# Altium project ESP32S3.PrjPcb
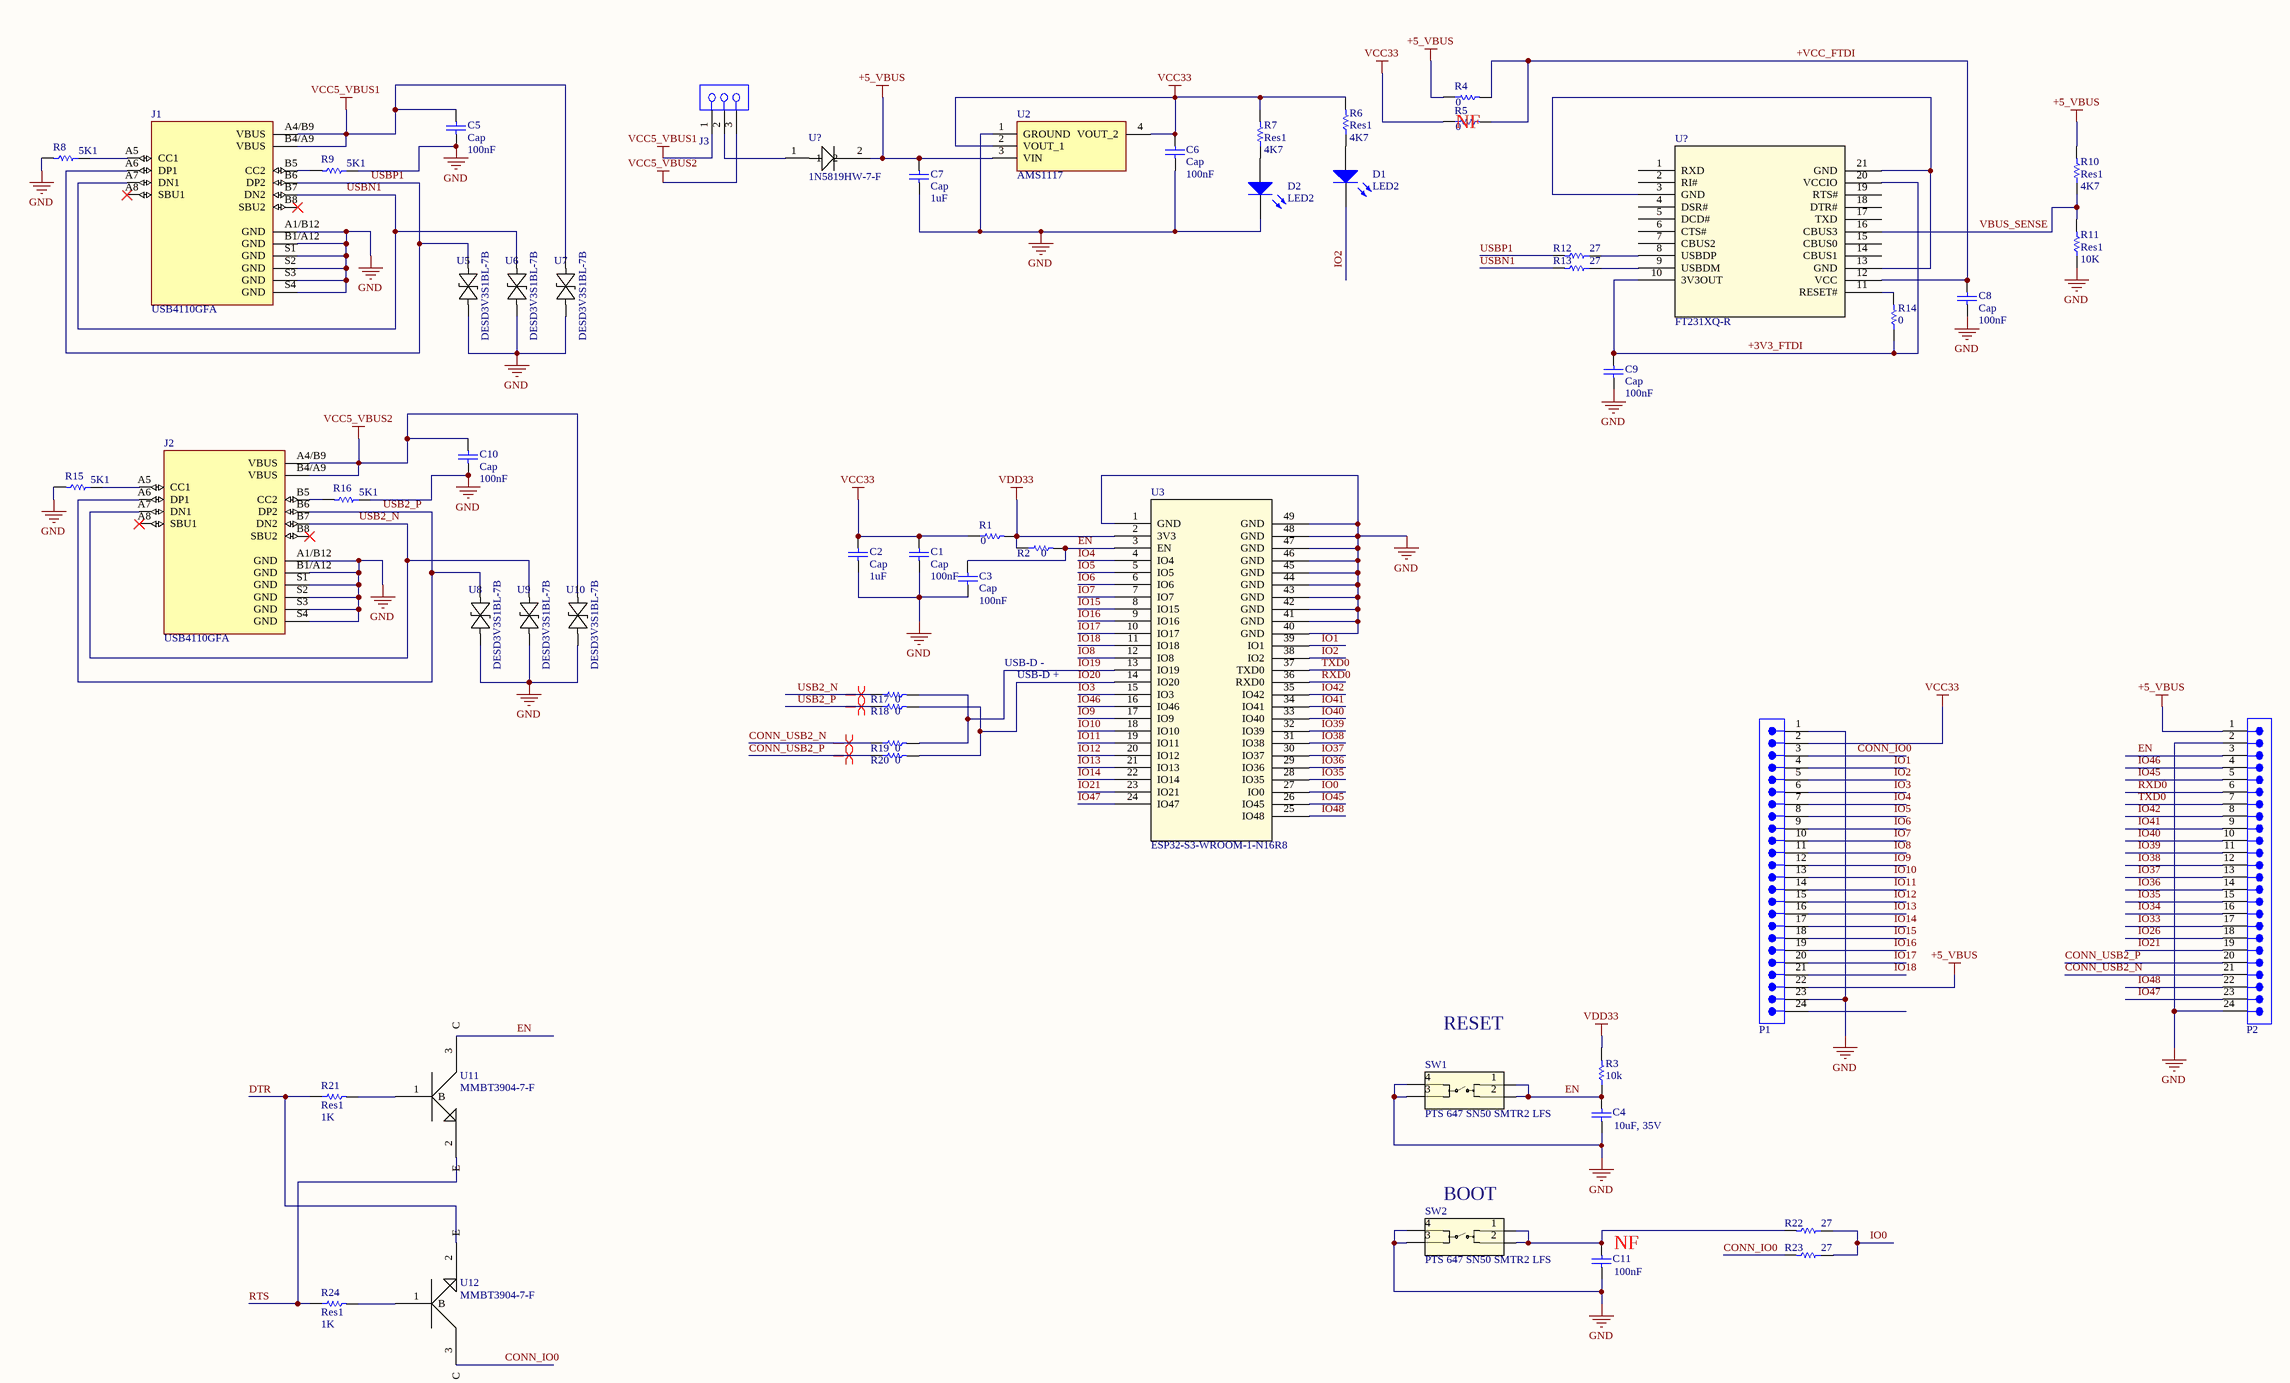
[diagram p0: esp32s3.SchDoc]
1 sheet, 56 parts. Net scope: global (net labels, ports and power ports of the same name join across sheets).
Board file: esp32s3.PcbDoc

## Sheet esp32s3.SchDoc
size C; SheetNumber: 1; SheetTotal: 1; SPICEModelCachePUVMUMUR: <root> / <DocumentId>PUVMUMUR</DocumentId> / <CacheFrame Number="0"> / <Model Name="led2" Kind="MDL"> / <Text>*Typ RED,GREEN,YELLOW,AMBER GaAs LED: Vf=2.1V Vr=4V If=40mA trr=3uS / *LED Pinout: 1=A, 2=K / .MODEL LED2 D (IS=93.1P RS=42M N=4.61 BV=4 IBV=10U / + CJO=2.97P VJ=.75 M=.333 TT=4.32U)</Text> / </Model> / </CacheFrame> / </root>

### Parts
(Parts that share a designator on the sheet are numbered #1, #2 ... from top to bottom, then left to right.)
C1  Cap  value 100nF  [C1206]
C2  Cap  value 1uF  [C1206]
C3  Cap  value 100nF  [C1206]
C4  value 10uF, 35V  [C1206]
C5  Cap  value 100nF  [C1206]
C6  Cap  value 100nF  [C1206]
C7  Cap  value 1uF  [C1206]
C8  Cap  value 100nF  [C1206]
C9  Cap  value 100nF  [C1206]
C10  Cap  value 100nF  [C1206]
C11  value 100nF  [C1206]
D1  LED2  [3.2X1.6X1.1]
D2  LED2  [3.2X1.6X1.1]
J1  USB4110GFA  [GCT_USB4110GFA]
J2  USB4110GFA  [GCT_USB4110GFA]
J3  61300311821  [61300311821]  (value not drawn)
P1  61302411121  [61302411121]  (value not drawn)
P2  61302411121  [61302411121]  (value not drawn)
R1  value 0  [C1206]
R2  value 0  [C1206]
R3  value 10k  [C1206]
R4  value 0  [C1206]
R5  value 0  [C1206]
R6  Res1  value 4K7  [C1206]
R7  Res1  value 4K7  [C1206]
R8  value 5K1  [C1206]
R9  value 5K1  [C1206]
R10  Res1  value 4K7  [C1206]
R11  Res1  value 10K  [C1206]
R12  value 27  [C1206]
R13  value 27  [C1206]
R14  value 0  [C1206]
R15  value 5K1  [C1206]
R16  value 5K1  [C1206]
R17  value 0  [C1206]
R18  value 0  [C1206]
R19  value 0  [C1206]
R20  value 0  [C1206]
R21  Res1  value 1K  [C1206]
R22  value 27  [C1206]
R23  value 27  [C1206]
R24  Res1  value 1K  [C1206]
SW1  PTS 647 SN50 SMTR2 LFS  [PTS 647 SN50 SMTR2 LFS-L]
SW2  PTS 647 SN50 SMTR2 LFS  [PTS 647 SN50 SMTR2 LFS-L]
U2  AMS1117  [SOT229P700X180-4N]
U3  ESP32-S3-WROOM-1-N16R8  [ESP32-S3-WROOM-1_EXP]
U5  DESD3V3S1BL-7B  [X1-DFN1006-2_RH_DIO]
U6  DESD3V3S1BL-7B  [X1-DFN1006-2_RH_DIO]
U7  DESD3V3S1BL-7B  [X1-DFN1006-2_RH_DIO]
U8  DESD3V3S1BL-7B  [X1-DFN1006-2_RH_DIO]
U9  DESD3V3S1BL-7B  [X1-DFN1006-2_RH_DIO]
U10  DESD3V3S1BL-7B  [X1-DFN1006-2_RH_DIO]
U11  MMBT3904-7-F  [SOT-23_1_DIO]
U12  MMBT3904-7-F  [SOT-23_1_DIO]
U?#1  1N5819HW-7-F  [1N5819HW-7-F_DIO]
U?#2  FT231XQ-R  [QFN20_FT231XQ_FTD]

### Nets
+5_VBUS: C7.2 P1.22 P2.1 R4.1 R10.2 U2.3(VIN) U?#1.2
GND: C1.1 C2.1 C3.1 C4.1 C5.1 C6.1 C7.1 C8.1 C9.1 C10.1 C11.1 D2.2(K) J1.A1/B12(GND) J1.B1/A12(GND) J1.S1(GND) J1.S2(GND) J1.S3(GND) J1.S4(GND) J2.A1/B12(GND) J2.B1/A12(GND) J2.S1(GND) J2.S2(GND) J2.S3(GND) J2.S4(GND) P1.1 P1.23 P2.2 P2.24 R8.2 R9.1 R11.1 R15.2 R16.1 SW1.3 SW1.4 SW2.3 SW2.4 U2.1(GROUND) U3.1(GND) U3.40(GND) U3.41(GND) U3.42(GND) U3.43(GND) U3.44(GND) U3.45(GND) U3.46(GND) U3.47(GND) U3.48(GND) U3.49(GND) U5.2 U6.2 U7.2 U8.2 U9.2 U10.2
VCC5_VBUS1: C5.2 J1.A4/B9(VBUS) J1.B4/A9(VBUS) J3.1 U7.1
VCC5_VBUS2: C10.2 J2.A4/B9(VBUS) J2.B4/A9(VBUS) J3.3 U10.1
VCC33: C1.2 C2.2 C6.2 P1.2 R1.1 R5.1 R6.2 R7.2 U2.2(VOUT_1) U2.4(VOUT_2)
VDD33: R1.2 R2.1 R3.2 U3.2(3V3)
+3V3_FTDI: C9.2 R14.1 U?#2.10(3V3OUT) U?#2.20(VCCIO)
+VCC_FTDI: C8.2 R4.2 R5.2 U?#2.12(VCC)
CONN_IO0: P1.3 R23.2
CONN_USB2_N: P2.21 R19.1
CONN_USB2_P: P2.20 R20.1
DTR: R21.1
EN: C3.2 C4.2 P2.3 R2.2 R3.1 SW1.1 SW1.2 U3.3(EN)
IO0: R22.1 R23.1 U3.27(IO0)
IO1: P1.4 U3.39(IO1)
IO2: D1.2(K) P1.5 U3.38(IO2)
IO3: P1.6 U3.15(IO3)
IO4: P1.7 U3.4(IO4)
IO5: P1.8 U3.5(IO5)
IO6: P1.9 U3.6(IO6)
IO7: P1.10 U3.7(IO7)
IO8: P1.11 U3.12(IO8)
IO9: P1.12 U3.17(IO9)
IO10: P1.13 U3.18(IO10)
IO11: P1.14 U3.19(IO11)
IO12: P1.15 U3.20(IO12)
IO13: P1.16 U3.21(IO13)
IO14: P1.17 U3.22(IO14)
IO15: P1.18 U3.8(IO15)
IO16: P1.19 U3.9(IO16)
IO17: P1.20 U3.10(IO17)
IO18: P1.21 U3.11(IO18)
IO19: R17.2 R19.2 U3.13(IO19)
IO20: R18.2 R20.2 U3.14(IO20)
IO21: P2.19 U3.23(IO21)
IO26: P2.18
IO33: P2.17
IO34: P2.16
IO35: P2.15 U3.28(IO35)
IO36: P2.14 U3.29(IO36)
IO37: P2.13 U3.30(IO37)
IO38: P2.12 U3.31(IO38)
IO39: P2.11 U3.32(IO39)
IO40: P2.10 U3.33(IO40)
IO41: P2.9 U3.34(IO41)
IO42: P2.8 U3.35(IO42)
IO45: P2.5 U3.26(IO45)
IO46: P2.4 U3.16(IO46)
IO47: P2.23 U3.24(IO47)
IO48: P2.22 U3.25(IO48)
RTS: R24.1
RXD0: P2.6 U3.36(RXD0)
TXD0: P2.7 U3.37(TXD0)
USB2_N: J2.A7(DN1) J2.B7(DN2) R17.1 U9.1
USB2_P: J2.A6(DP1) J2.B6(DP2) R18.1 U8.1
USBN1: J1.A7(DN1) J1.B7(DN2) R13.2 U6.1
USBP1: J1.A6(DP1) J1.B6(DP2) R12.2 U5.1
VBUS_SENSE: R10.1 R11.2 U?#2.16(CBUS3)
NetC11_2: C11.2 R22.2 SW2.1 SW2.2
NetD1_1: D1.1(A) R6.1
NetD2_1: D2.1(A) R7.1
NetJ1_A5: J1.A5(CC1) R8.1
NetJ1_B5: J1.B5(CC2) R9.2
NetJ2_A5: J2.A5(CC1) R15.1
NetJ2_B5: J2.B5(CC2) R16.2
NetJ3_2: J3.2 U?#1.1
NetR12_1: R12.1 U?#2.8(USBDP)
NetR13_1: R13.1 U?#2.9(USBDM)
NetR14_2: R14.2 U?#2.11(RESET#)
NetR21_2: R21.2 U11.1(B)
NetR24_2: R24.2 U12.1(B)
NetU?#2_3: U?#2.3(GND) U?#2.13(GND) U?#2.21(GND)

Not connected (* = marked no-connect by the designer): J1 A8(SBU1)* B8(SBU2)*; J2 A8(SBU1)* B8(SBU2)*; P1 24; U11 2(E) 3(C); U12 2(E) 3(C); U?#2 1(RXD) 2(RI#) 4(DSR#) 5(DCD#) 6(CTS#) 7(CBUS2) 14(CBUS1) 15(CBUS0) 17(TXD) 18(DTR#) 19(RTS#)

### Layout directives
differential pair; differential pair class DIFF90: CONN_USB2_N, CONN_USB2_P, USB2_N, USB2_P

### Notes on the sheet
- (near R5) NF
- USB-D -
- USB-D +
- RESET
- (near SW2) BOOT
- (near C11) NF

### Library data of the parts
C1-C11 = Cap: Capacitor; Published: 8-Jun-2000; LatestRevisionDate: 17-Jul-2002; LatestRevisionNote: Re-released for DXP Platform.; PackageReference: RAD-0.3; Publisher: Altium Limited; PackageDescription: Radial Cap, Thru-Hole; 2 Leads; 0.3 in Pin Spacing
D1 D2 = LED2: Typical RED, GREEN, YELLOW, AMBER GaAs LED; Published: 8-Jun-2000; LatestRevisionDate: 17-Jul-2002; LatestRevisionNote: Re-released for DXP Platform.; PackageVersion: Feb-2002; PackageReference: 3.2X1.6X1.1; Publisher: Altium Limited; PackageDescription: SM LED; 2 Flat Leads
J1 J2 = USB4110GFA: USB-C (USB TYPE-C) USB 2.0 Receptacle Connector 24 (16+8 Dummy) Position Surface Mount, Right Angle; MF: Global Connector Technology; SnapEDA_Link: https://www.snapeda.com/parts/USB4110GFA/Global+Connector+Technology/view-part/?ref=snap; Package: None; Value: *; MP: USB4110GFA; Check_prices: https://www.snapeda.com/parts/USB4110GFA/Global+Connector+Technology/view-part/?ref=eda
J3 = 61300311821: WR-PHD Socket Header, THT, Vertical, pitch 2.54mm, 1 Row, 3P; Manufacturer: Wurth Elektronik; Contact Resistance: 20mOhm; Rated Current: 3A; Working Voltage: 250V; Withstanding Voltage: 500V; Manufacturer Part Number: 61300311821; Category: Board-to-Board Connectors; Match Code: WR-PHD; ComponentLink1Description: Website Link; ComponentLink1URL: https://www.we-online.com/redexpert/article/61300311821?ad; ComponentLink2Description: Datasheet Link; ComponentLink2URL: https://www.we-online.com/redexpert/spec/61300311821?ad; Mount: Through Hole; Operating Temperature Max: 125°C; Operating Temperature Min: -40°C; Packaging: Tray; Gender: Socket Header; Number of Pins: 3; Number of Rows: 1; Orientation: Vertical; Pitch: 2.54mm
P1 P2 = 61302411121: WR-PHD Pin Header, THT, Vertical, pitch 2.54mm, 1 Row, 24P; Manufacturer: Wurth Elektronik; Contact Resistance: 20mOhm; Rated Current: 3A; Working Voltage: 250V; Withstanding Voltage: 500V; Manufacturer Part Number: 61302411121; Category: Board-to-Board Connectors; Match Code: WR-PHD; ComponentLink1Description: Website Link; ComponentLink1URL: https://www.we-online.com/redexpert/article/61302411121?ad; ComponentLink2Description: Datasheet Link; ComponentLink2URL: https://www.we-online.com/redexpert/spec/61302411121?ad; Mount: Through Hole; Operating Temperature Max: 105°C; Operating Temperature Min: -40°C; Packaging: Bag; Gender: Pin Header; Number of Pins: 24; Number of Rows: 1; Orientation: Vertical; Pitch: 2.54mm
R1-R24 = Res1: Resistor; Published: 8-Jun-2000; LatestRevisionDate: 17-Jul-2002; LatestRevisionNote: Re-released for DXP Platform.; PackageReference: AXIAL-0.3; Publisher: Altium Limited; PackageDescription: Axial Device, Thru-Hole; 2 Leads; 0.3 in Pin Spacing
SW1 SW2 = PTS 647 SN50 SMTR2 LFS: No Description Available; Mfr_Name: C&K Components; RefDes: RefDes; Type: Type
U2 = AMS1117: 1117; Manufacturer_Name: Advanced Monolithic Systems; Geometry.Height: 1.8mm; Manufacturer_Part_Number: AMS1117; Mouser Part Number: *; Mouser Price/Stock: *; Arrow Part Number: *; Arrow Price/Stock: *; Datasheet Link: https://datasheet.lcsc.com/szlcsc/Advanced-Monolithic-Systems-AMS-AMS1117-ADJ_C6188.pdf
U3 = ESP32-S3-WROOM-1-N16R8: No Description Available; Mfr_Name: Espressif Systems; RefDes: RefDes; Type: Type
U5-U10 = DESD3V3S1BL-7B: No Description Available; Mfr_Name: Diodes Inc
U11 U12 = MMBT3904-7-F: No Description Available; Mfr_Name: Diodes Inc; RefDes: RefDes; Type: Type
U?#1 = 1N5819HW-7-F: No Description Available; Mfr_Name: Diodes Inc; RefDes: RefDes; Type: Type
U?#2 = FT231XQ-R: No Description Available; Mfr_Name: FTDI, Future Technology Devices International Ltd; RefDes: RefDes; Type: Type